# Altium schematic sheet SOIC28.SchDoc
size B
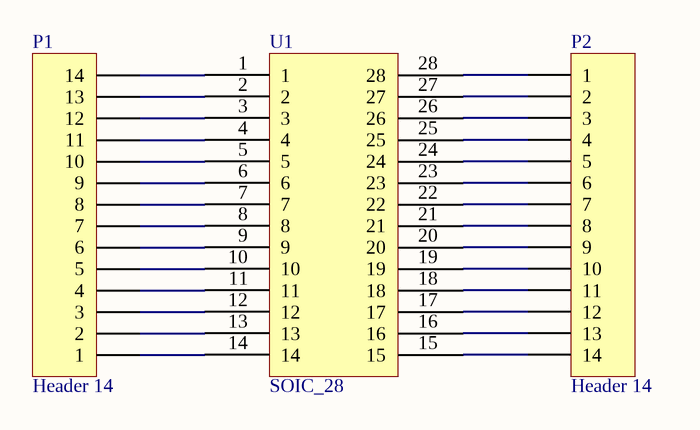
[diagram p0: SOIC28.SchDoc]

## Parts
P1  Header 14  [HDR1X14]
P2  Header 14  [HDR1X14]
U1  SOIC_28  [SOIC28]

## Nets
NetP1_1: P1.1 U1.14
NetP1_2: P1.2 U1.13
NetP1_3: P1.3 U1.12
NetP1_4: P1.4 U1.11
NetP1_5: P1.5 U1.10
NetP1_6: P1.6 U1.9
NetP1_7: P1.7 U1.8
NetP1_8: P1.8 U1.7
NetP1_9: P1.9 U1.6
NetP1_10: P1.10 U1.5
NetP1_11: P1.11 U1.4
NetP1_12: P1.12 U1.3
NetP1_13: P1.13 U1.2
NetP1_14: P1.14 U1.1
NetP2_1: P2.1 U1.28
NetP2_2: P2.2 U1.27
NetP2_3: P2.3 U1.26
NetP2_4: P2.4 U1.25
NetP2_5: P2.5 U1.24
NetP2_6: P2.6 U1.23
NetP2_7: P2.7 U1.22
NetP2_8: P2.8 U1.21
NetP2_9: P2.9 U1.20
NetP2_10: P2.10 U1.19
NetP2_11: P2.11 U1.18
NetP2_12: P2.12 U1.17
NetP2_13: P2.13 U1.16
NetP2_14: P2.14 U1.15

## Library data of the parts
P1 P2 = Header 14: Header, 14-Pin; LatestRevisionDate: 17-Jul-2002; LatestRevisionNote: Re-released for DXP Platform.; Publisher: Altium Limited